# EasyEDA Pro project 新Exlink多功能调试器.epro, schematic 功率控制板

## Sheets
1 电源部分: Board Name: 功率控制板; Create Date: 2024-09-24; Page Name: 电源部分; Project Name: 改进新Exlink多功能调试器（分立叠板）; Schematic Name: 功率控制板; Update Date: 2024-10-16; Company: 嘉立创EDA; Page Size: A4; Version: V1.0
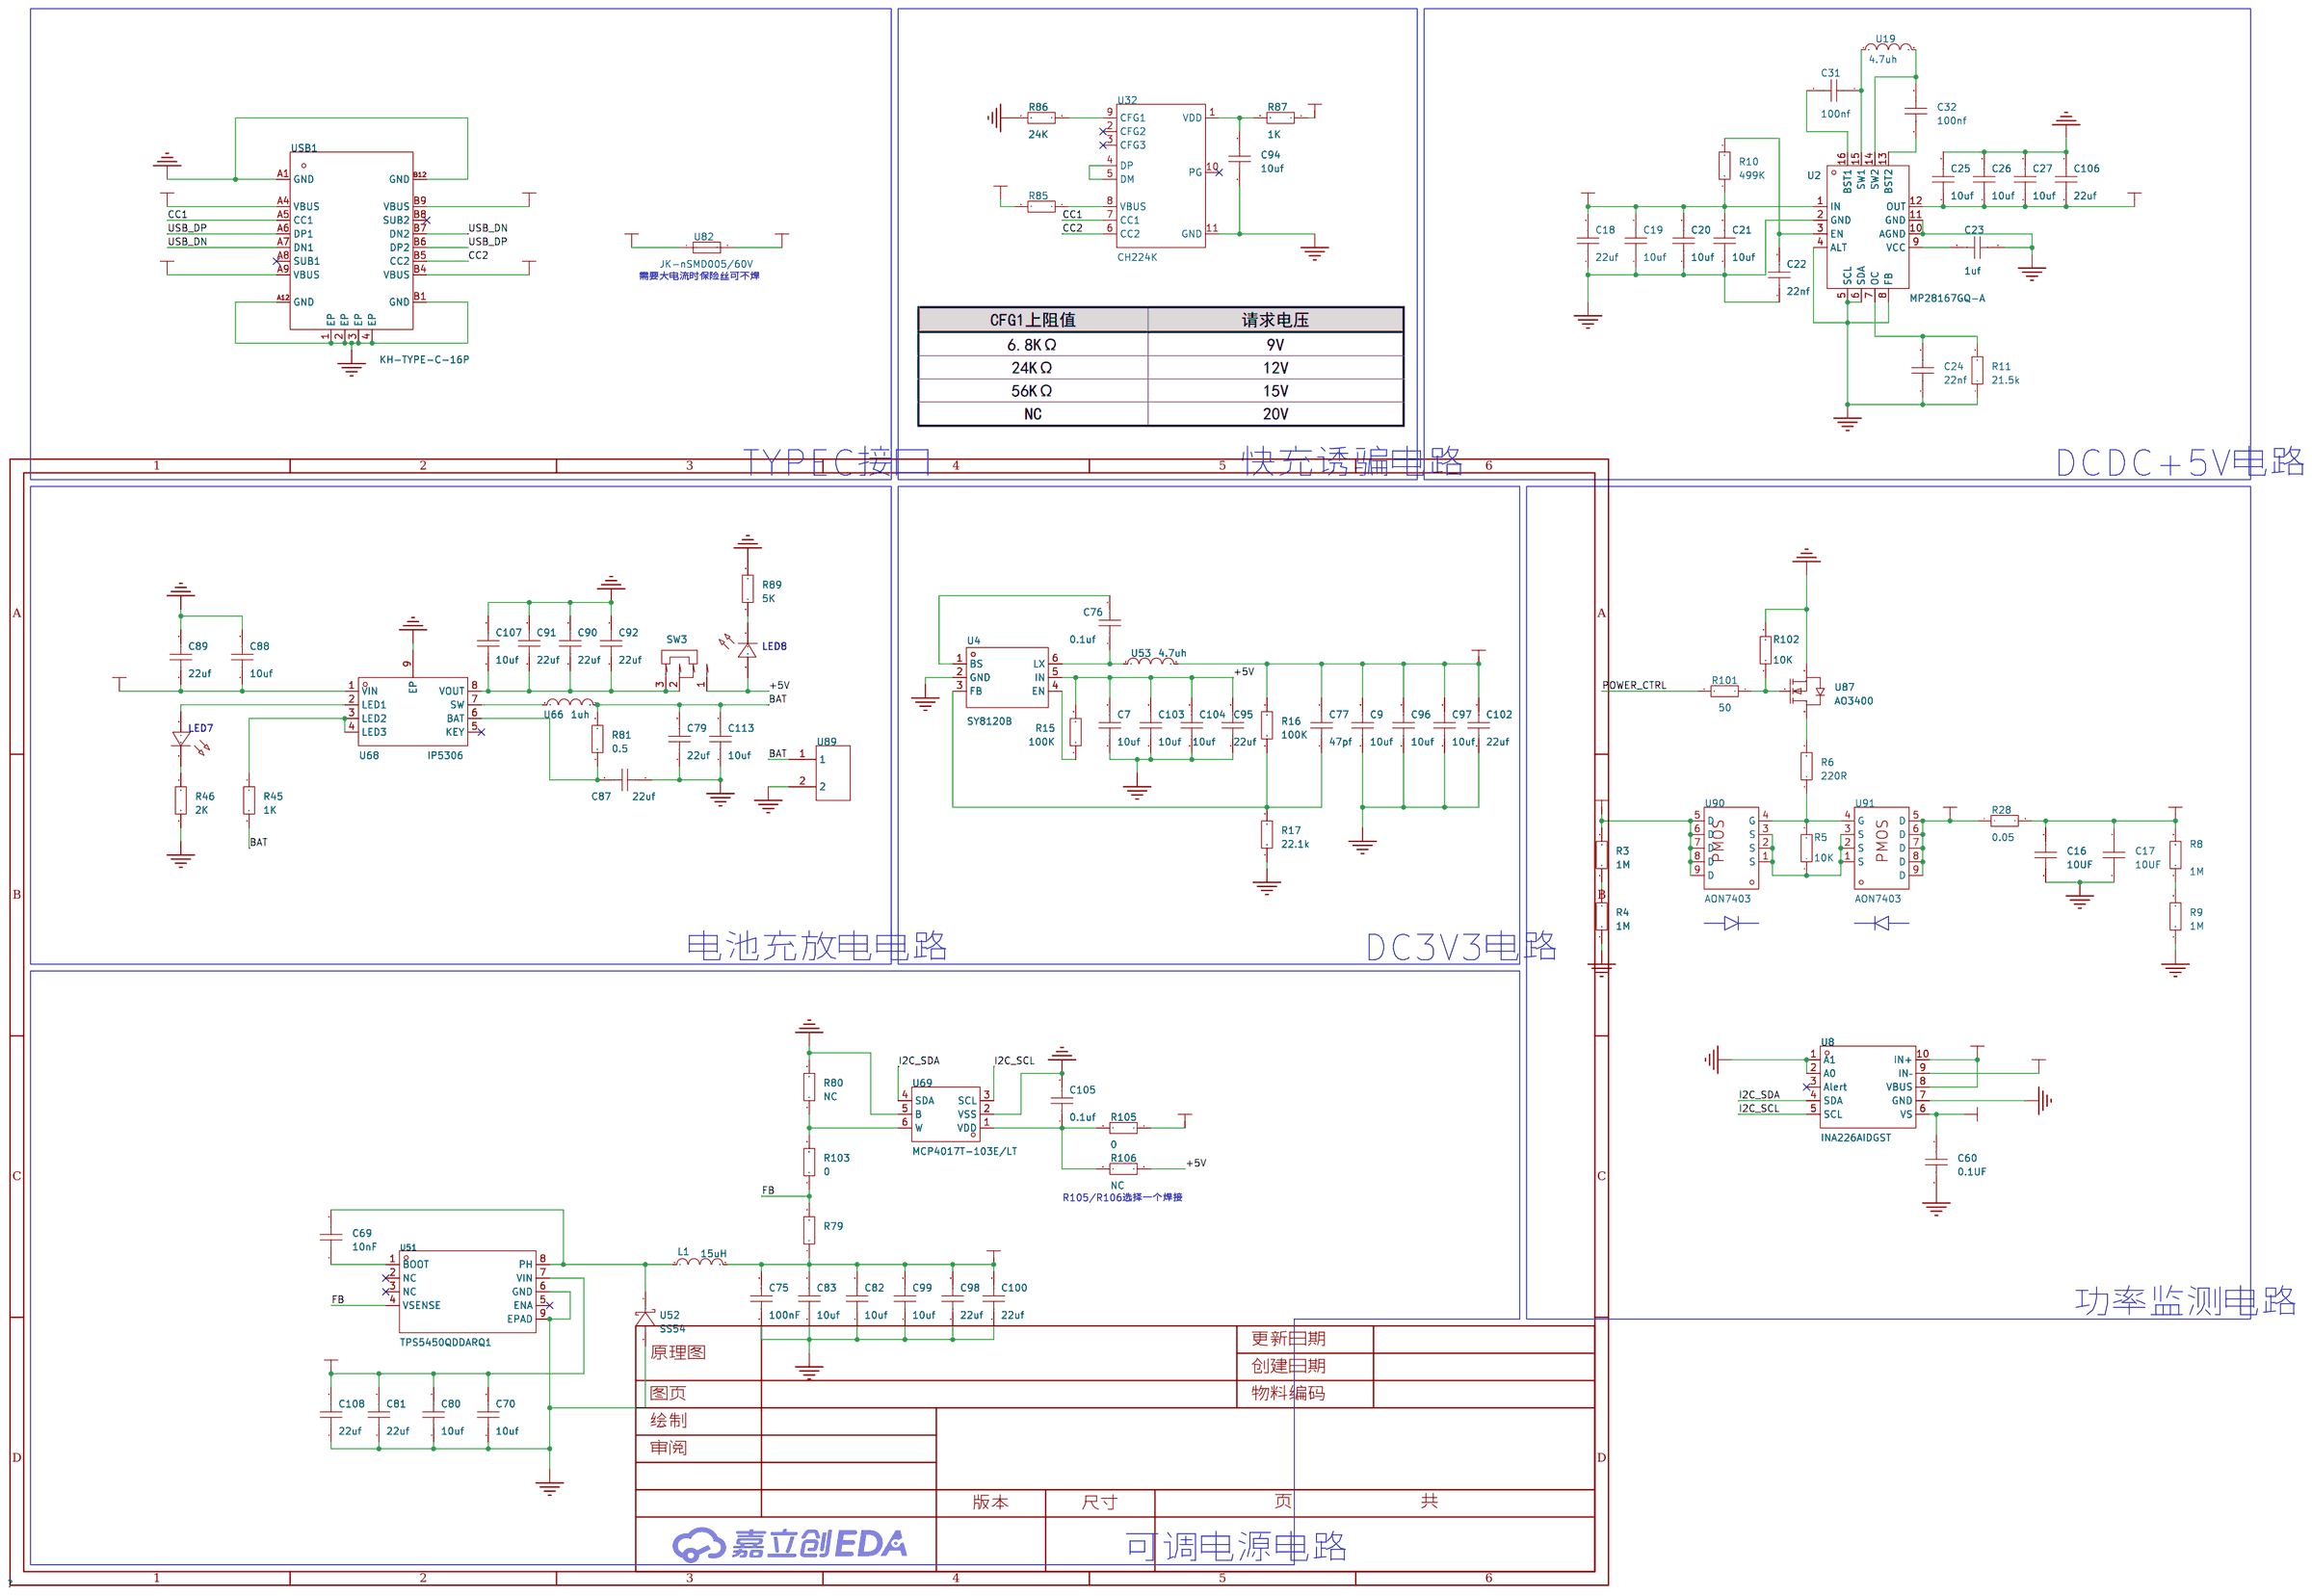
[diagram p1: 电源部分]
2 主控部分: Page Name: 主控部分; Update Date: 2024-10-17
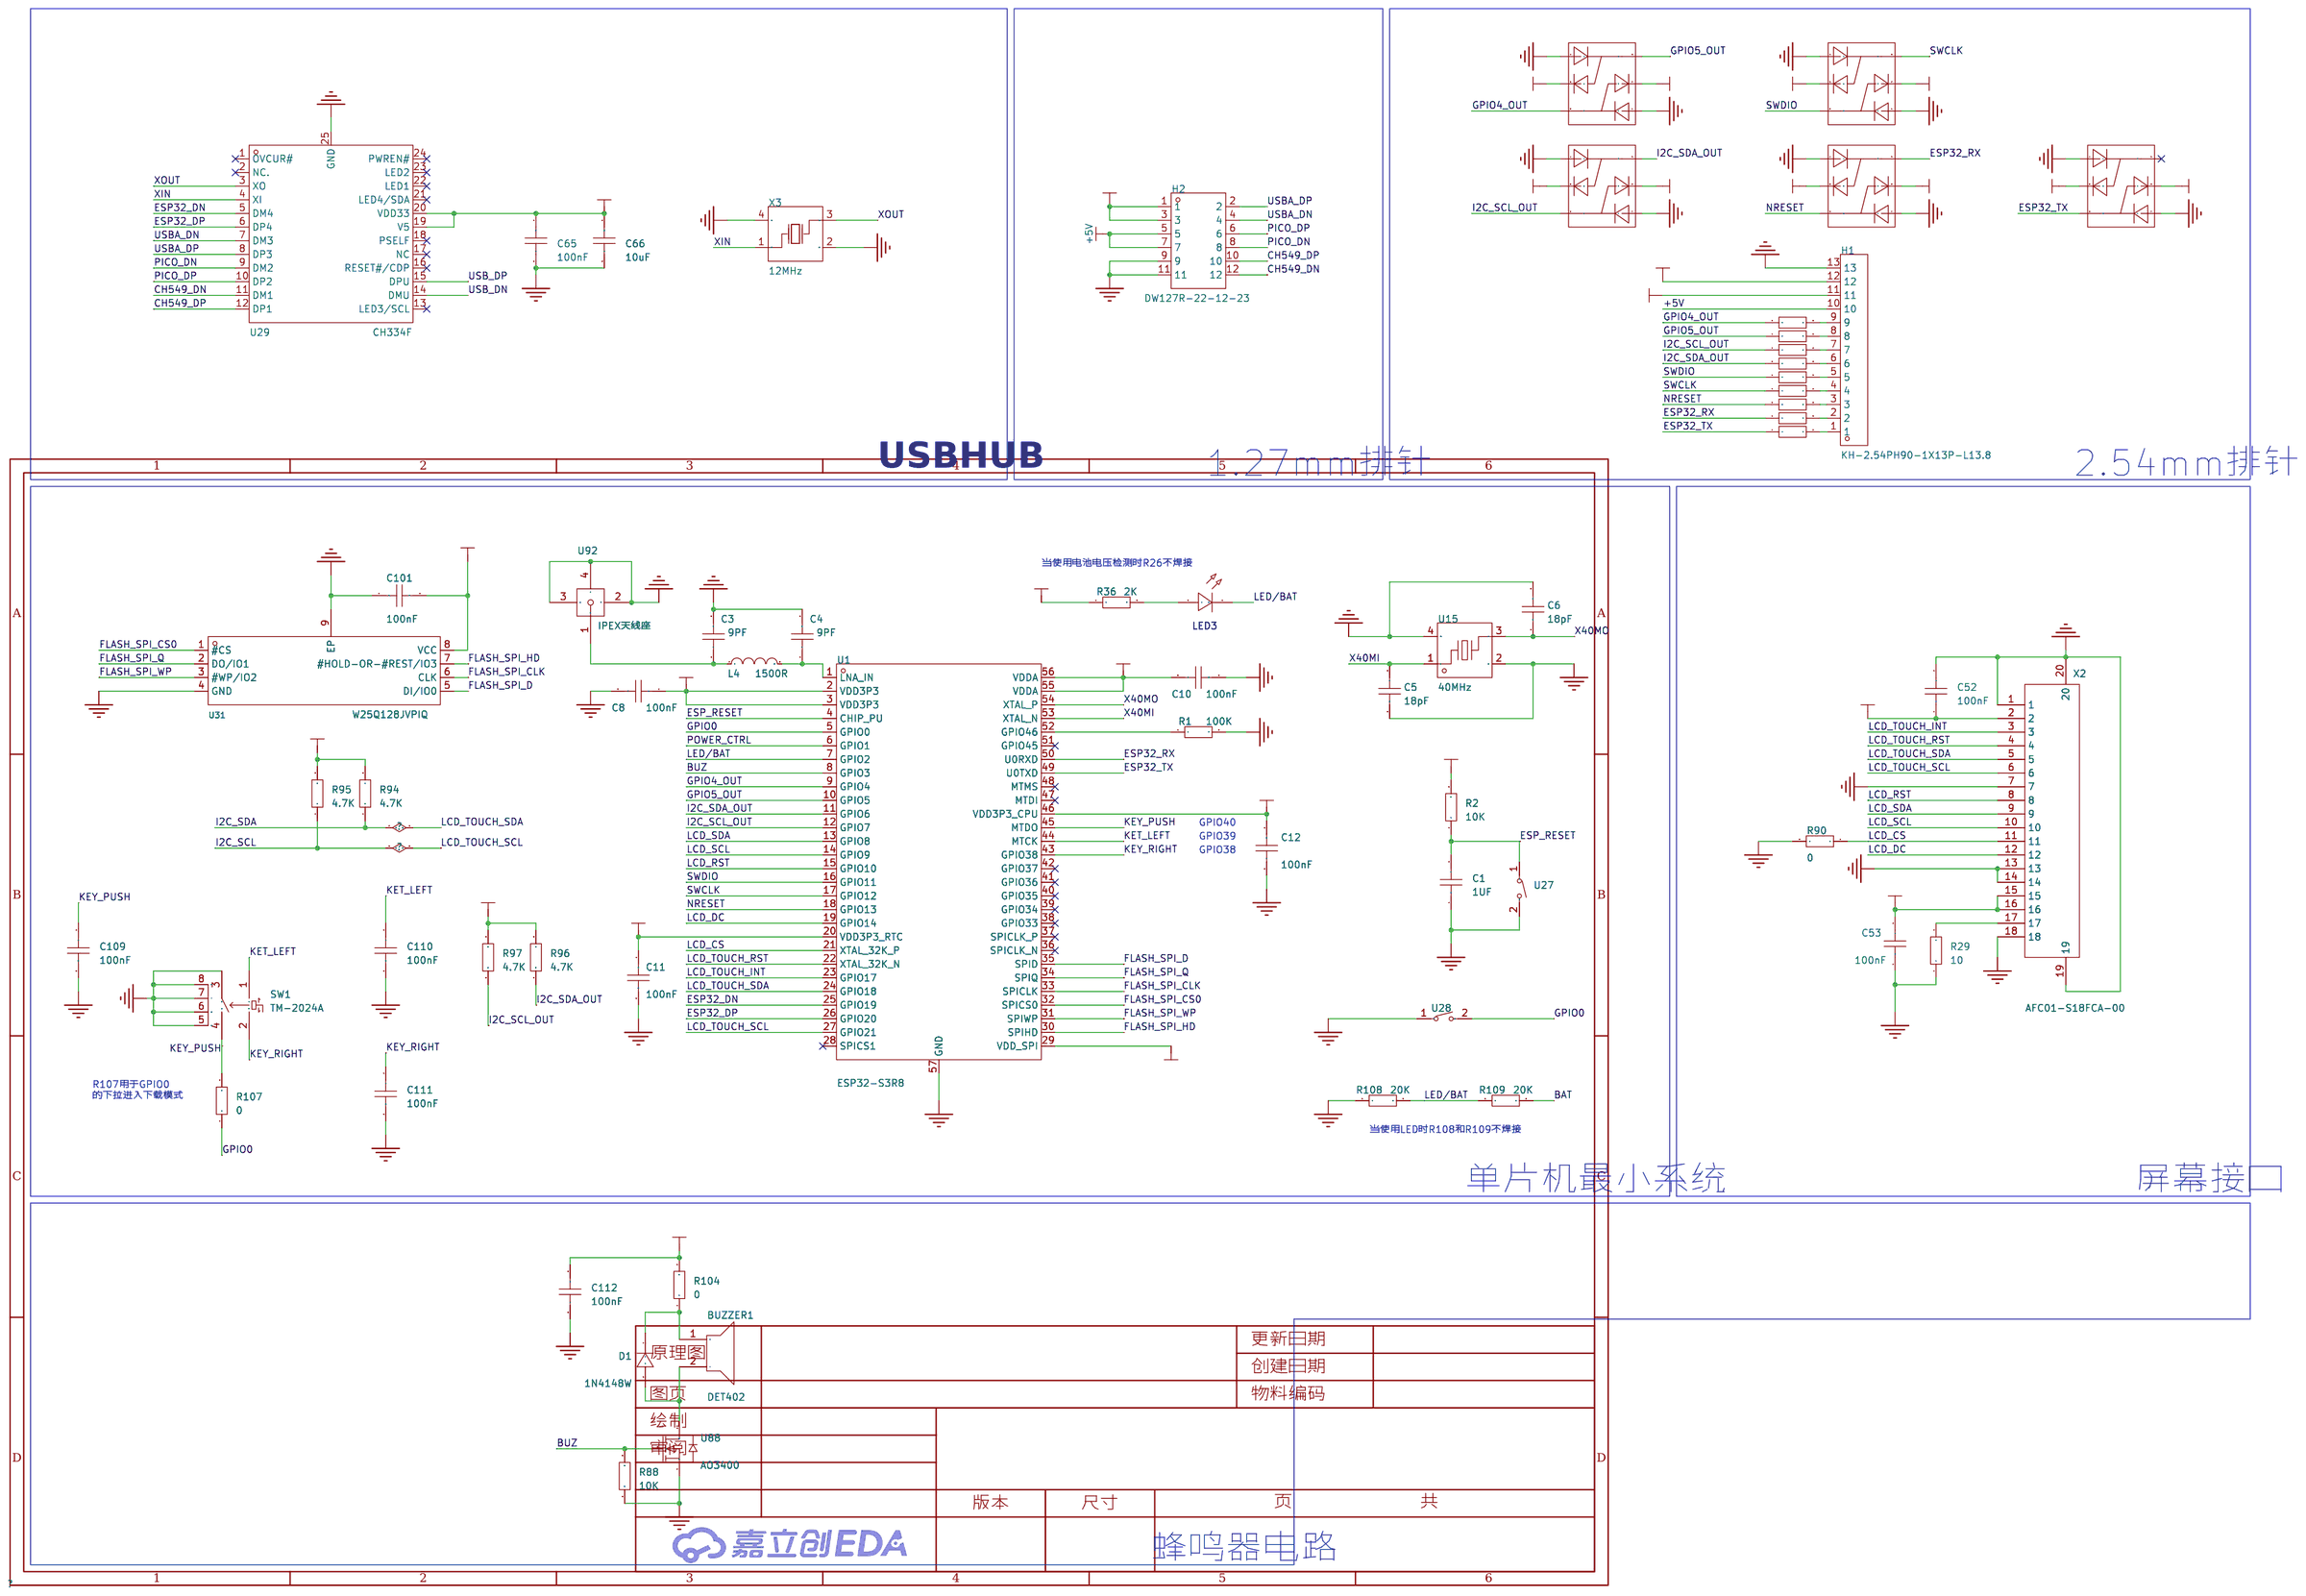
[diagram p2: 主控部分]
3 系统框图: Create Date: 2024-10-17; Page Name: 系统框图; Update Date: 2024-10-17
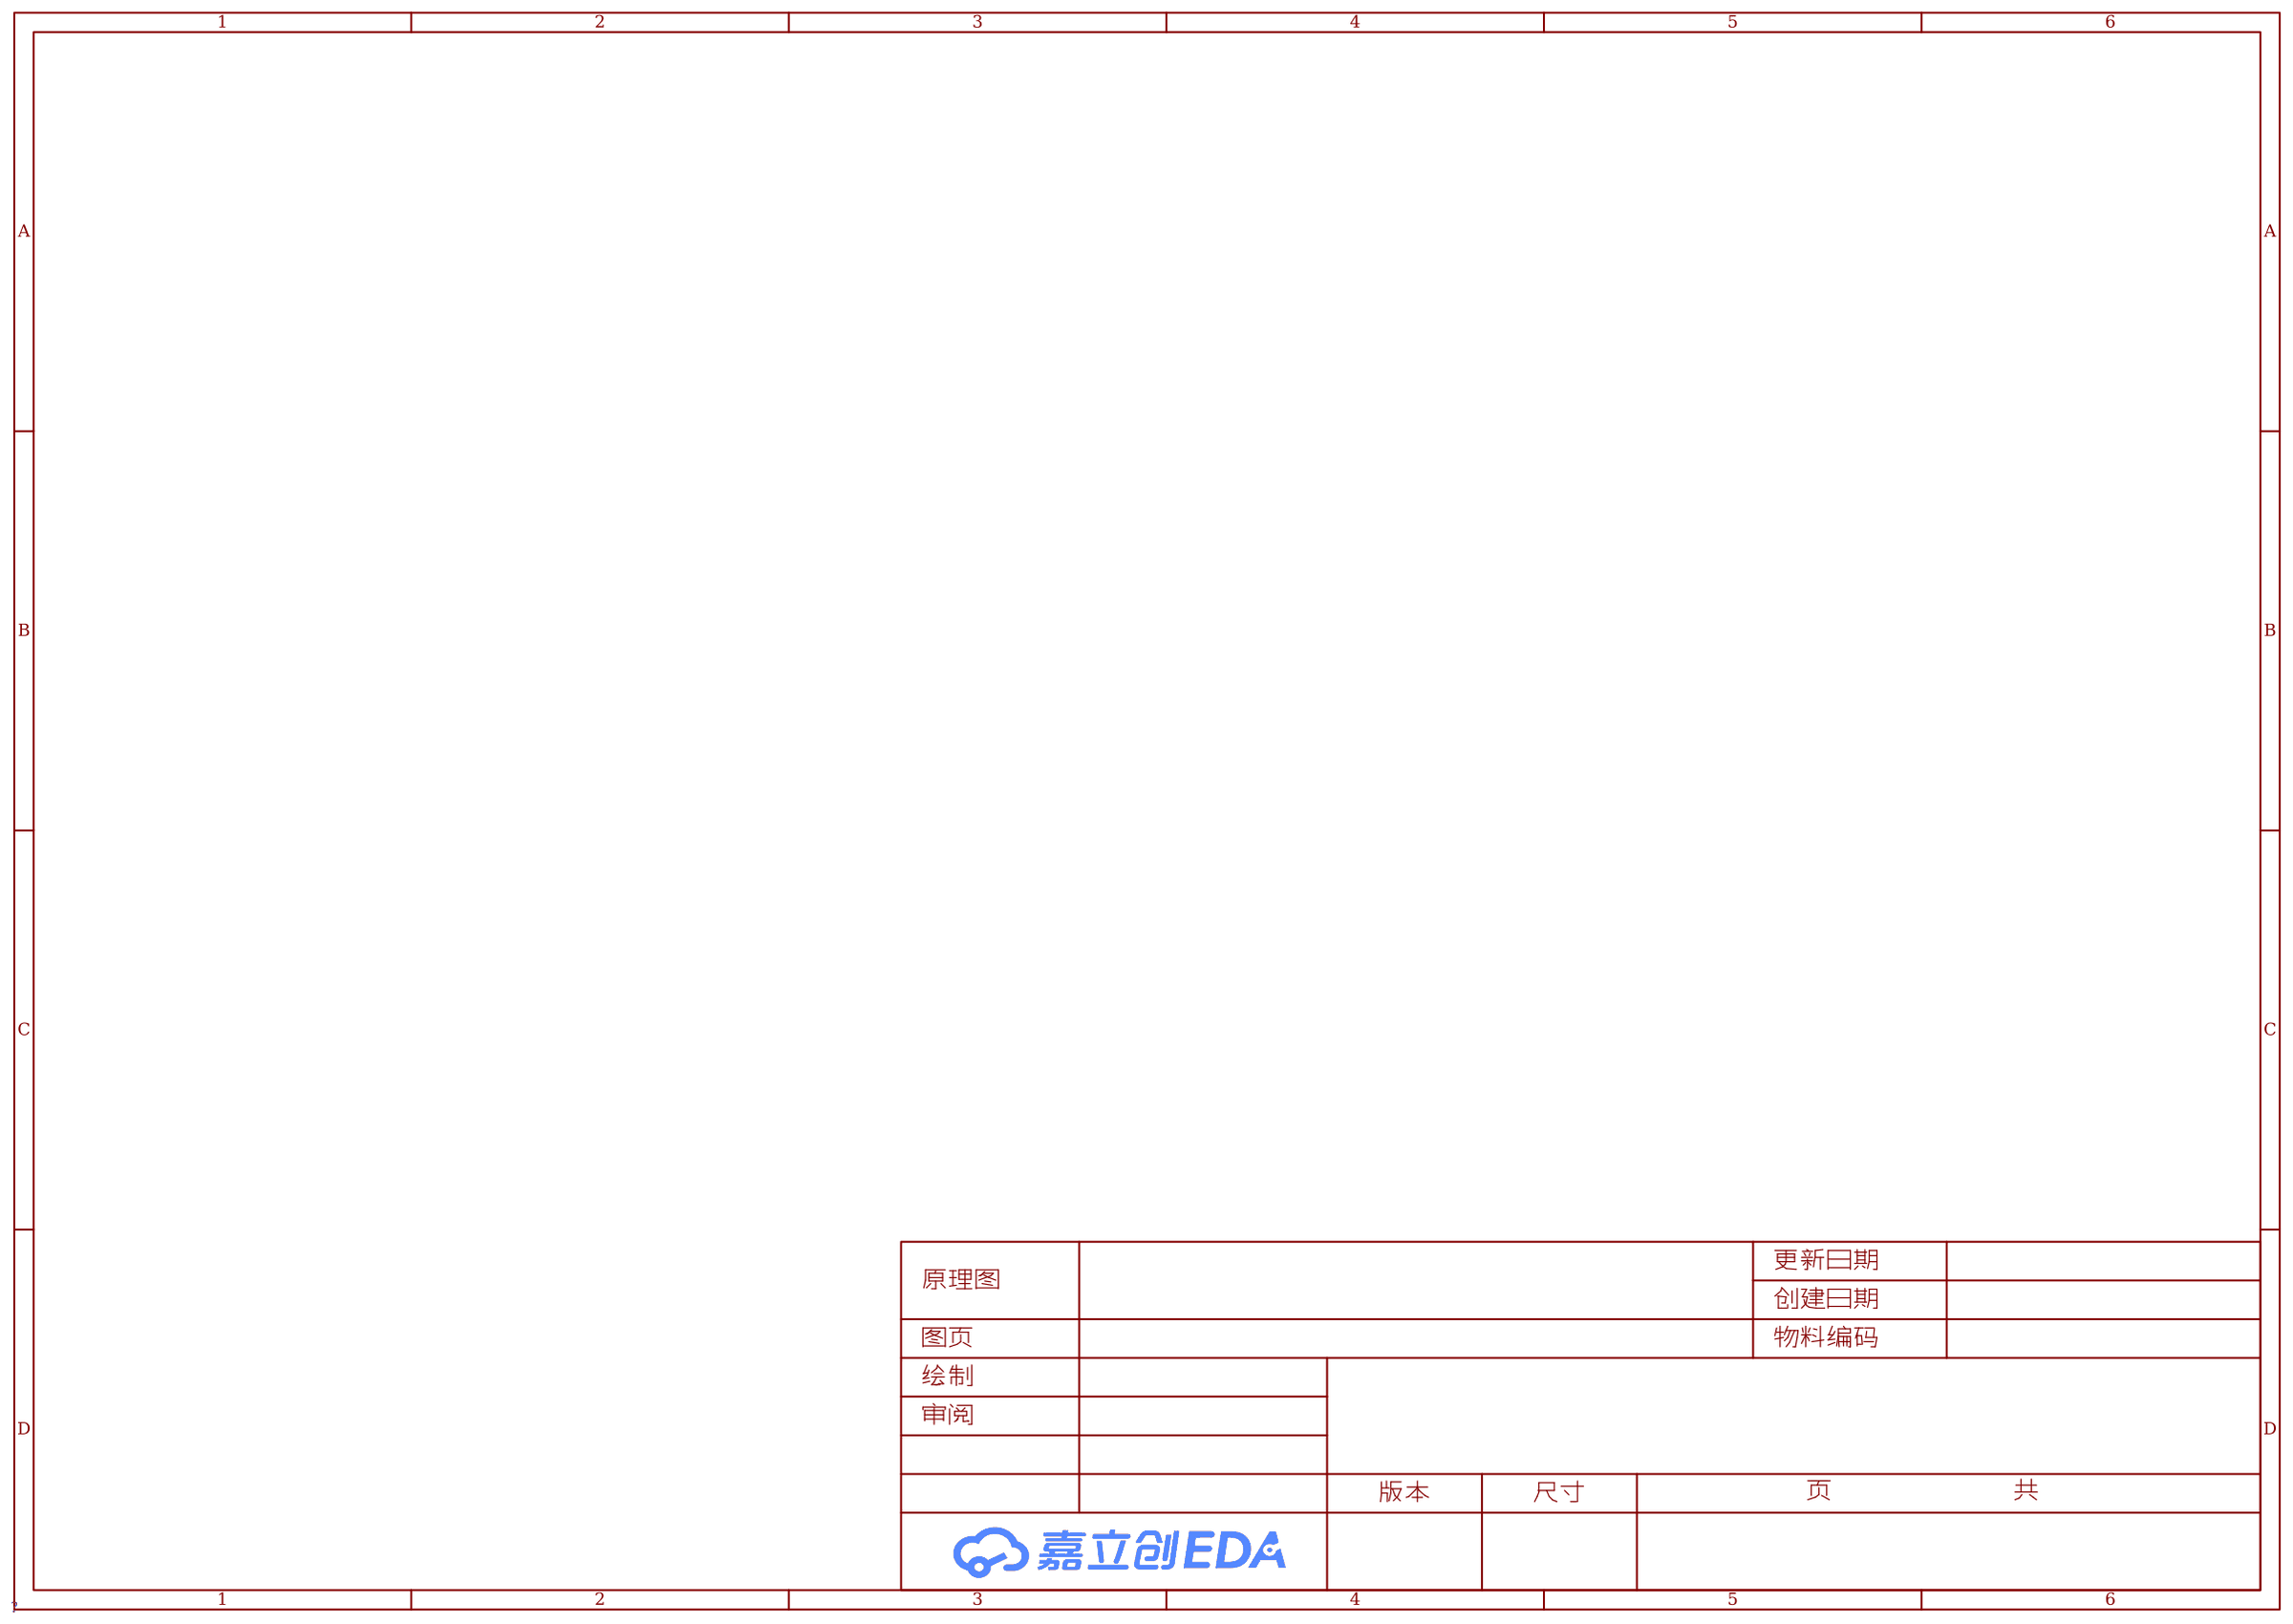
[diagram p3: 系统框图]

## Parts
sheet 主控部分
BUZZER1  DET402  [BUZ-SMD_L4.0-W3.0-LS4.5-FD]
C1  1UF  [C0402]
C3  9PF  [C0402]
C4  9PF  [C0402]
C5  18pF  [C0402]
C6  18pF  [C0402]
C8  100nF  [C0402]
C10  100nF  [C0402]
C11  100nF  [C0402]
C12  100nF  [C0402]
C52  100nF  [C0402]
C53  100nF  [C0402]
C65  100nF  [C0402]
C66  10uF  [C0402]
C101  100nF  [C0402]
C109  100nF  [C0402]
C110  100nF  [C0402]
C111  100nF  [C0402]
C112  100nF  [C0402]
D1  1N4148W  [SOD-123F_L2.7-W1.6-LS3.8-RD]
H1  KH-2.54PH90-1X13P-L13.8  [HDR-TH_13P-P2.54-H-M-W10.4-N]
H2  DW127R-22-12-23  [HDR-TH_12P-P1.27-V-M-R2-C6-S1.27-1]
L4  1500R  [L0402]
LED3  -  [LED_0402]
R1  100K  [R0402]
R2  10K  [R0402]
R29  10  [R0402]
R36  2K  [R0402]
R49  33Ω  [R0402]
R50  33Ω  [R0402]
R51  33Ω  [R0402]
R52  33Ω  [R0402]
R53  33Ω  [R0402]
R54  33Ω  [R0402]
R55  33Ω  [R0402]
R56  33Ω  [R0402]
R57  33Ω  [R0402]
R88  10K  [R0402]
R90  0  [R0402]
R94  4.7K  [R0402]
R95  4.7K  [R0402]
R96  4.7K  [R0402]
R97  4.7K  [R0402]
R104  0  [R0402]
R107  0  [R0402]
R108  20K  [R0402]
R109  20K  [R0402]
SW1  TM-2024A  [SW-SMD_TM-2024A]
U1  ESP32-S3R8  [QFN-56_L7.0-W7.0-P0.40-TL-EP4.0]
U15  40MHz  [CRYSTAL-SMD_4P-L3.2-W2.5-BL]
U27  TC-S3403-2.0-260G  [SW-SMD_L4.0-W3.0-LS5.0]
U28  TC-S3403-2.0-260G  [SW-SMD_L4.0-W3.0-LS5.0]
U29  CH334F  [QFN-24_L4.0-W4.0-P0.50-BL-EP2.8]
U31  W25Q128JVPIQ  [WSON-8_L6.0-W5.0-P1.27-BL-EP]
U71  BAV99S  [SOT-363-6_L2.0-W1.3-P0.65-LS2.1-BL]
U83  BAV99S  [SOT-363-6_L2.0-W1.3-P0.65-LS2.1-BL]
U84  BAV99S  [SOT-363-6_L2.0-W1.3-P0.65-LS2.1-BL]
U85  BAV99S  [SOT-363-6_L2.0-W1.3-P0.65-LS2.1-BL]
U86  BAV99S  [SOT-363-6_L2.0-W1.3-P0.65-LS2.1-BL]
U88  AO3400  [SOT-23-3_L2.9-W1.3-P1.90-LS2.4-BL-2]
U92  IPEX天线座  [IPEX-SMD_HC-RF-IPEX0303-01]
X2  AFC01-S18FCA-00  [FPC-SMD_18P-P0.50_JS_AFC01-S18FCA-00]
X3  12MHz  [OSC-SMD_4P-L3.2-W2.5-BL]
sheet 电源部分
C7  10uf  [C0402]
C9  10uf  [C0402]
C16  10UF  [C0402]
C17  10UF  [C0402]
C18  22uf  [C0402]
C19  10uf  [C0402]
C20  10uf  [C0402]
C21  10uf  [C0402]
C22  22nf  [C0402]
C23  1uf  [C0402]
C24  22nf  [C0402]
C25  10uf  [C0402]
C26  10uf  [C0402]
C27  10uf  [C0402]
C31  100nf  [C0402]
C32  100nf  [C0402]
C60  0.1UF  [C0402]
C69  10nF  [C0402]
C70  10uf  [C0402]
C75  100nF  [C0402]
C76  0.1uf  [C0402]
C77  47pf  [C0402]
C79  22uf  [C0402]
C80  10uf  [C0402]
C81  22uf  [C0402]
C82  10uf  [C0402]
C83  10uf  [C0402]
C87  22uf  [C0402]
C88  10uf  [C0402]
C89  22uf  [C0402]
C90  22uf  [C0402]
C91  22uf  [C0402]
C92  22uf  [C0402]
C94  10uf  [C0402]
C95  22uf  [C0402]
C96  10uf  [C0402]
C97  10uf  [C0402]
C98  22uf  [C0402]
C99  10uf  [C0402]
C100  22uf  [C0402]
C102  22uf  [C0402]
C103  10uf  [C0402]
C104  10uf  [C0402]
C105  0.1uf  [C0402]
C106  22uf  [C0402]
C107  10uf  [C0402]
C108  22uf  [C0402]
C113  10uf  [C0402]
L1  15uH  [IND-SMD_L4.0-W4.0_FNR40XXS]
LED7  -  [LED_0402]
LED8  -  [LED_0402]
R3  1M  [R0402]
R4  1M  [R0402]
R5  10K  [R0402]
R6  220R  [R0402]
R8  1M  [R0402]
R9  1M  [R0402]
R10  499K  [R0402]
R11  21.5k  [R0402]
R15  100K  [R0402]
R16  100K  [R0402]
R17  22.1k  [R0402]
R28  0.05  [R1206]
R45  1K  [R0402]
R46  2K  [R0402]
R79  10K  [R0402]
R80  NC  [R0402]
R81  0.5  [R0402]
R85  10K  [R0402]
R86  24K  [R0402]
R87  1K  [R0402]
R89  5K  [R0402]
R101  50  [R0402]
R102  10K  [R0402]
R103  0  [R0402]
R105  0  [R0402]
R106  NC  [R0402]
SW3  SK-3245S-L1-A  [SW-SMD_SK-3245S-L1-A-1]
U2  MP28167GQ-A  [QFN-16_L3.0-W3.0-P0.50_MP28167GQ-Z]
U4  SY8120B  [SOT-23-6_L2.9-W1.6-P0.95-LS2.8-BL]
U8  INA226AIDGST  [VSSOP-10_L3.0-W3.0-P0.50-LS4.9-BL]
U19  4.7uh  [IND-SMD_L2.5-W2.0_YXNAQ252010-3R3M]
U32  CH224K  [ESSOP-10_L4.9-W3.9-P1.0-LS6.0-TL-EP]
U51  TPS5450QDDARQ1  [SOIC-8_L4.9-W3.9-P1.27-LS6.0-BL-EP]
U52  SS54  [SMA_L4.2-W2.6-LS5.1-RD]
U53  4.7uh  [IND-SMD_L2.5-W2.0_YXNAQ252010-3R3M]
U66  1uh  [IND-SMD_L2.5-W2.0_YXNAQ252010-3R3M]
U68  IP5306  [ESOP-8_L4.9-W3.9-P1.27-LS6.0-BL-EP]
U69  MCP4017T-103E/LT  [SC-70-6_L2.2-W1.3-P0.65-LS2.1-BR]
U82  JK-nSMD005/60V  [F1206]
U87  AO3400  [SOT-23-3_L2.9-W1.3-P1.90-LS2.4-BL-2]
U89  -  [电池接口]
U90  AON7403  [DFN-8_L3.0-W3.0-P0.65-BL]
U91  AON7403  [DFN-8_L3.0-W3.0-P0.65-BL]
USB1  KH-TYPE-C-16P  [USB-C-SMD_KH-TYPE-C-16P]

## Library data of the parts
BUZZER1 = DET402: Supplier Part: C2911630; Supplier Footprint: SMD; JLCPCB Part Class: 扩展库; Supplier: LCSC
C1 C5 C6 C8 C10-C12 C16-C27 C31 C32 C79-C83 C87-C92 C94 C98-C101 C105-C113 = CAP_0603: Supplier Footprint: 0603
C3 C4 C52 C53 C60 C65 C66 = CAP_0402: Supplier Footprint: 0402
D1 = 1N4148W_C81598: 二极管配置:独立式;正向压降(Vf):1V@50mA;直流反向耐压(Vr):75V;平均整流电流(Io):150mA;功率:400mW;反向恢复时间(trr):4ns;; LCSC Part Name: 电压:75V 电流:150mA; Supplier Part: C81598; Manufacturer: ST(先科); Supplier Footprint: SOD-123; JLCPCB Part Class: 基础库; Datasheet: https://atta.szlcsc.com/upload/public/pdf/source/20161024/1477288446905.pdf; Supplier: LCSC; Diode Configuration: 独立式; Forward Voltage (Vf@If): 1V@50mA; Reverse Voltage (Vr): 75V; Average Rectified Current (Io): 150mA; Power Dissipation: 400mW; Reverse Leakage Current: 1uA@75V; Reverse Recovery Time (trr): 4ns
H1 = KH-2.54PH90-1X13P-L13.8: 插针结构:1x13P;间距:2.54mm;行距:-;圆针/方针:方针;安装类型:弯插;排数:单排;总PIN位数:13P;额定电流:3A;额定电压:-;配合针长度:6mm;塑高:2.5mm;端接针长度:-;工作温度范围:-40℃~+105℃;颜色:黑色;; LCSC Part Name: 间距:2.54mm 1x13P 弯插 方针; Supplier Part: C2932694; Manufacturer: kinghelm(金航标); Supplier Footprint: 弯插,P=2.54mm; JLCPCB Part Class: 扩展库; Datasheet: https://atta.szlcsc.com/upload/public/pdf/source/20211220/56DAC73D7461283ED3EEF54E5429CBF7.pdf; Supplier: LCSC; Pin Structure: 1x13P; Pitch: 2.54mm; Circluar Pins/Square Pins: 方针; Mounting Type: 弯插; Number of Rows: 单排; Number of Pins: 13P; Current Rating (Max): 3A; Length of Mating Pin: 6mm; Insulation Height: 2.5mm; Operating Temperature Range: -40℃~+105℃; Color: 黑色
H2 = DW127R-22-12-23: 插针结构:2x6P;间距:1.27mm;行距:1.27mm;圆针/方针:方针;安装类型:直插;排数:双排;总PIN位数:12P;额定电流:1A;额定电压:-;配合针长度:3mm;塑高:1mm;端接针长度:2.3mm;工作温度范围:-;颜色:-;; LCSC Part Name: 间距:1.27mm 2x6P 直插 方针; Supplier Part: C2935954; Manufacturer: DEALON(德艺隆); Supplier Footprint: 插件,P=1.27mm; JLCPCB Part Class: 扩展库; Datasheet: https://atta.szlcsc.com/upload/public/pdf/source/20220110/33FE2FFCEFD15AF13AB1987E70EA4ABA.pdf; Supplier: LCSC; Pin Structure: 2x6P; Pitch: 1.27mm; Row Spacing: 1.27mm; Circluar Pins/Square Pins: 方针; Mounting Type: 直插; Number of Rows: 双排; Number of Pins: 12P; Current Rating (Max): 1A; Length of Mating Pin: 3mm; Insulation Height: 1mm; Length of End Connection Pin: 2.3mm
L4 = L_0402
LED3 = LED_0402-G: Supplier Footprint: 0402
R1-R6 R8-R11 R36 R45 R46 R81 R88 R89 R94-R97 R101 R102 R104 R107-R109 = Res_0603: Supplier Footprint: 0603
R29 R90 = Res_0402: Supplier Footprint: 0402
R49-R57 = RC0201FR-072R2L: 电阻类型:厚膜电阻;阻值:2.2Ω;精度:±1%;功率:50mW;; LCSC Part Name: 2.2Ω ±1% 50mW; Supplier Part: C138154; Manufacturer: YAGEO(国巨); Supplier Footprint: 0201; JLCPCB Part Class: 扩展库; Datasheet: https://atta.szlcsc.com/upload/public/pdf/source/20171107/C138154_15100517264731097049.pdf; Supplier: LCSC; Type: 厚膜电阻; Tolerance: ±1%; Power(Watts): 50mW; Temperature Coefficient: -100ppm/℃~+350ppm/℃; Overload Voltage (Max): 25V; Operating Temperature Range: -55℃~+125℃
SW1 = TM-2024A: 四脚两档拨轮开关TM-2024A; LCSC Part Name: 四脚两档拨轮开关TM-2024A; Supplier Part: C561480; Manufacturer: XKB Connection(中国星坤); Supplier Footprint: SMD; JLCPCB Part Class: 扩展库; Datasheet: https://atta.szlcsc.com/upload/public/pdf/source/20211011/7A4DB3DC37E7D5823B6D92C66ED3191E.pdf; Supplier: LCSC
U1 = ESP32-S3R8: 频率范围:2.412GHz~2.484GHz;接口:I2C,I2S,SPI,UART,USB;应用领域:蓝牙,WiFi;数据速率:150Mbps;灵敏度:-98.4dBm;; Supplier Part: C2913194; Manufacturer: ESPRESSIF(乐鑫); Supplier Footprint: QFN-56(7x7); JLCPCB Part Class: 扩展库; Datasheet: https://atta.szlcsc.com/upload/public/pdf/source/20231007/CDA236FFCB3F25B7D5220D2CA9867287.pdf; Supplier: LCSC; Frequency Range: 2.412GHz~2.484GHz; Interface: I2C,I2S,SPI,UART,USB; Operating Voltage: 3.3V; Applications: 蓝牙,WiFi; Output Power: 21dBm; Data Rate: 150Mbps; Sensitivity: -98.4dBm; Operating Temperature: -40℃~+85℃
U15 = L327S400H11L: 晶振类型:贴片晶振;频率:40MHz;常温频差:±10ppm;外接负载电容:10pF;; LCSC Part Name: 40MHz ±10ppm 10pF; Supplier Part: C5261245; Manufacturer: Lucki(蓝晶); Supplier Footprint: SMD3225-4P; Datasheet: https://atta.szlcsc.com/upload/public/pdf/source/20221202/3BD521BEB23A8C516134756D2665894B.pdf; Supplier: LCSC; Crystal Type: 贴片晶振; Normal temperature Frequency Tolerance: ±10ppm; External load capacitor: 10pF; Operating Temperature: -40℃~+85℃
U27 U28 = TC-S3403-2.0-260G: 连接器类型：3.5mm耳机座 额定电流：500mA 额定电压：30V 工作温度范围：-20℃~+70℃ 焊接温度(最大值)：235℃ 3.5音频连接器 5脚3级插脚 音响耳机插座; Supplier Part: C5372844; Manufacturer: HCTL(华灿天禄); Supplier Footprint: SMD; Datasheet: https://atta.szlcsc.com/upload/public/pdf/source/20230320/549E467C3F97F31F1E4EF0A0B79060CE.pdf; Supplier: LCSC
U29 = CH334F: Supplier Part: C9900029063; Supplier Footprint: QFN24_4x4; Supplier: LCSC
U31 = W25Q128JVPIQ_C190862: 存储容量:128Mbit;; Supplier Part: C190862; Manufacturer: WINBOND(华邦); Supplier Footprint: WSON-8-EP(5x6); JLCPCB Part Class: 扩展库; Datasheet: https://atta.szlcsc.com/upload/public/pdf/source/20190705/C401662_06B6D416F67ED315879B366F63A3F7C9.pdf; Supplier: LCSC; Memory Size: 128Mbit
U71 U83-U86 = BAV99S_1: 二极管配置:2对串联式;正向压降(Vf):1.25V@150mA;直流反向耐压(Vr):85V;平均整流电流(Io):150mA;反向恢复时间(trr):6ns;; LCSC Part Name: 电压:85V 电流:150mA; Supplier Part: C19267766; Manufacturer: HXY MOSFET(华轩阳电子); Supplier Footprint: SOT-363; JLCPCB Part Class: 扩展库; Datasheet: https://atta.szlcsc.com/upload/public/pdf/source/20231127/314B1A7F84308C808926EA57C3E5ACE3.pdf; Supplier: LCSC; Diode Configuration: 2对串联式; Forward Voltage (Vf@If): 1.25V@150mA; Reverse Voltage (Vr): 85V; Average Rectified Current (Io): 150mA; Reverse Recovery Time (trr): 6ns
U87 U88 = AO3400: Supplier Part: C9900013365; Supplier Footprint: SOT-23; JLCPCB Part Class: 扩展库; Supplier: LCSC
U92 = IPEX天线座: Supplier Part: C9900012747; Supplier Footprint: IPEX-SMD; JLCPCB Part Class: 扩展库; Supplier: LCSC
X2 = AFC01-S18FCA-00: 间距:0.5mm;触点数量:18;锁定特性:翻盖式;安装类型:卧贴;触点类型:下接;工作温度范围:-;; LCSC Part Name: 0.5mmP数:18翻盖式下接; Supplier Part: C262666; Manufacturer: JS(钜硕电子); Supplier Footprint: SMD,P=0.5mm; JLCPCB Part Class: 扩展库; Datasheet: https://atta.szlcsc.com/upload/public/pdf/source/20190816/C413942_2A72D1AC756EAE17EEDF756A339D4500.pdf; Supplier: LCSC; Pitch: 0.5mm; Number of Contacts: 18; Locking Feature: 翻盖式; Mounting Type: 卧贴; Contact Type: 下接; Height Above Board: 2mm; FFC, FCB Thickness: 0.3mm
X3 = X322512MSB4SI: 晶振类型:贴片晶振;频率:12MHz;常温频差:±10ppm;外接负载电容:20pF;频率稳定度(全温):±20ppm;; LCSC Part Name: 12MHz ±10ppm 20pF; Supplier Part: C9002; Manufacturer: YXC(扬兴晶振); Supplier Footprint: SMD3225-4P; JLCPCB Part Class: 基础库; Datasheet: https://atta.szlcsc.com/upload/public/pdf/source/20240329/19D5F850207469550BEB00D7DFEDBC7A.pdf; Supplier: LCSC; Crystal Type: 贴片晶振; Normal temperature Frequency Tolerance: ±10ppm; External load capacitor: 20pF; Frequency Stability(Full temperature range): ±20ppm; Operating Temperature: -40℃~+85℃
C7 C9 C69 C70 C75-C77 C95-C97 C102-C104 = CAP_0805: Supplier Footprint: 0805
L1 = FNR4020S4R7MT: 电感值:4.7uH;精度:±20%;额定电流:1.34A;直流电阻(DCR):98mΩ;; LCSC Part Name: 4.7uH ±20% 1.34A 98mΩ; Supplier Part: C167828; Manufacturer: cjiang(长江微电); Supplier Footprint: SMD,4x4x2mm; JLCPCB Part Class: 扩展库; Datasheet: https://atta.szlcsc.com/upload/public/pdf/source/20190327/C167828_0C146B75E465FFC746F4145E84B3A0D4.pdf; Supplier: LCSC; Tolerance: ±20%; Rated Current: 1.34A; DC Resistance (DCR): 98mΩ
LED7 LED8 = LED_0603-G: Supplier Footprint: 0603
R15-R17 R79 R80 R85-R87 R103 R105 R106 = Res_0805: Supplier Footprint: 0805
R28 = Res_1206: Supplier Footprint: 1206
SW3 = SK-3245S-L1-A: 电路结构:双刀双掷;安装方式:卧贴;开关颜色:黑色;额定电流(DC):50mA;额定电压(DC):12V;额定电流(AC):50mA;额定电压(AC):12V;机械寿命:1万次;; LCSC Part Name: 柄长2mm 卧贴双档 滑动开关; Supplier Part: C405951; Manufacturer: XKB Connection(中国星坤); Supplier Footprint: SMD; JLCPCB Part Class: 扩展库; Datasheet: https://atta.szlcsc.com/upload/public/pdf/source/20200227/C405951_CBAB505F81ACCB08512C6DA919ADD92C.pdf; Supplier: LCSC; Circuit: 双刀双掷; Actuator Style: 矩形柱状; Pin Style: SMD接片; Switch Length: 9.1mm; Switch Width: 3.55mm; Switch Height: 3.2mm; Mounting Style: 卧贴; Actuator Color: 黑色; Current Rating (DC): 50mA; Voltage Rating (DC): 12V; Current Rating (AC): 50mA; Voltage Rating (AC): 12V; Mechanical Life: 1万次; Operating Temperature: -40℃~+85℃
U2 = MP28167GQ-A: Supplier Part: C3445916; Supplier Footprint: QFN-16(3x3); JLCPCB Part Class: 扩展库; Supplier: LCSC
U4 = SY8120B: LCSC Part Name: 2A, 18V, 600KHz同步降压转换器; Supplier Part: C5330397; Manufacturer: Slkor(萨科微); Supplier Footprint: SOT-23-6; Datasheet: https://atta.szlcsc.com/upload/public/pdf/source/20221213/05E3E36F9B4BD6CBAE1D86C5271B65DD.pdf; Supplier: LCSC
U8 = INA226AIDGST: INA226 具有警报功能的 36V、16 位、超精密 I2C 输出电流/电压/功率监控器; Supplier Part: C2653870; Manufacturer: TI(德州仪器); Supplier Footprint: VSSOP-10-0.5mm; Datasheet: https://www.ti.com/cn/lit/gpn/ina226; Supplier: LCSC
U19 U53 U66 = IND\L2.5XW: Supplier Part: C9900016568; Supplier Footprint: 2.2uH/60; JLCPCB Part Class: 扩展库; Supplier: LCSC
U32 = CH224K: 应用功能:USB充电芯片;; LCSC Part Name: USB PD等多快充协议受电芯片CH224; Supplier Part: C970725; Manufacturer: WCH(南京沁恒); Supplier Footprint: ESSOP-10-150mil-1mm; JLCPCB Part Class: 扩展库; Datasheet: https://atta.szlcsc.com/upload/public/pdf/source/20240313/43C2AFDDBDD1F65B60386D2CCAB0811B.pdf; Supplier: LCSC; Applications Function: USB充电芯片
U51 = TPS5450QDDARQ1: 功能类型:降压型;输出类型:可调;输入电压:5.5V~36V;输出电压:1.221V~32.04V;输出电流(最大值):5A;; Supplier Part: C181270; Manufacturer: TI(德州仪器); Supplier Footprint: SOP-8-EP; JLCPCB Part Class: 扩展库; Datasheet: https://www.ti.com/cn/lit/gpn/tps5450-q1; Supplier: LCSC; Function: 降压型; Synchronous Rectification: 否; Output Type: 可调; Number of Outputs: 1; Topology: 降压式; Input Voltage: 5.5V~36V; Output Voltage: 1.221V~32.04V; Output Current (Max): 5A; Switching Frequency: 500kHz; Operating Temperature: -40℃~+125℃@(TJ)
U52 = SS54: Supplier Part: C9900023219; Supplier Footprint: (1N5824)DO-214; JLCPCB Part Class: 扩展库; Supplier: LCSC
U68 = IP5306: 2.1A充电2.4A放电高集成度移动电源SOC; Supplier Part: C181692; Manufacturer: INJOINIC(英集芯); Supplier Footprint: ESOP-8; JLCPCB Part Class: 扩展库; Datasheet: https://atta.szlcsc.com/upload/public/pdf/source/20190627/C384572_9925B3DDC4041BC6108E5AB46A2A0AB1.pdf; Supplier: LCSC
U69 = MCP4017T-103E/LT: 电阻值(欧姆):10kΩ;接口类型:I2C;供电电压:1.8V~5.5V;精度:±20%;; Supplier Part: C623396; Manufacturer: MICROCHIP(美国微芯); Supplier Footprint: SC-70-6; JLCPCB Part Class: 扩展库; Datasheet: https://atta.szlcsc.com/upload/public/pdf/source/20171212/C145561_15130636359521177681.pdf; Supplier: LCSC; Resistance Value (Ohms): 10kΩ; Number of Taps: 128; Interface Type: I2C; Number of Channels: 1; Supply Voltage: 1.8V~5.5V; Precision: ±20%; Temperature Coefficient (Typ): 150ppm/℃; Operating Temperature: -40℃~+125℃
U82 = JK-nSMD005/60V: 最大电压:60V;最大电流:100A;保持电流:50mA;跳闸电流:150mA;; LCSC Part Name: 60V 0.05A 1206自恢复; Supplier Part: C2830235; Manufacturer: JK(金科); Supplier Footprint: 1206; Datasheet: https://atta.szlcsc.com/upload/public/pdf/source/20210427/C2830251_B9511B640A50AD6A91174E2DDDD254CA.pdf; Supplier: LCSC; Operating Voltage (Max): 60V; Current Rating (Max): 100A; Hold Current: 50mA; Trip Current: 150mA; Resistance - Initial (Ri) (Min): 3.6Ω; Resistance - Post Trip (R1) (Max): 50Ω; Maximum Time to Trip: 1.5s; Operating Temperature: -40℃~+85℃
U89 = 电池接口
U90 U91 = AON7403_C5310961: Supplier Part: C5310961; Manufacturer: TECH PUBLIC(台舟); Supplier Footprint: PDFN-8; JLCPCB Part Class: 扩展库; Datasheet: https://atta.szlcsc.com/upload/public/pdf/source/20221212/36DA98EDFE73327CB4574501A775E746.pdf; Supplier: LCSC
USB1 = KH-TYPE-C-16P: 连接器类型:Type-C;标准:-;公母:母;端口数量:1;触点数量:16P;安装方式:卧贴;额定电流 - 电源:3A;工作温度范围:-40℃~+85℃;; LCSC Part Name: Type-C 母 卧贴; Supplier Part: C709357; Manufacturer: kinghelm(金航标); Supplier Footprint: SMD; Datasheet: https://atta.szlcsc.com/upload/public/pdf/source/20200911/C709357_AA8DCEB38BB20E3035A7ED7AE7667837.pdf; Supplier: LCSC; Connector Type: Type-C; Gender: 母; Number of Ports: 1; Number of Contacts: 16P; Mounting Style: 卧贴; Current Rating - Power (Max): 3A; Operating Temperature Range: -40℃~+85℃

## Nets
3V3: C8.1 C9.2 C10.2 C11.1 C12.1 C52.1 C53.2 C60.1 C65.1 C66.1 C77.2 C96.2 C97.2 C102.2 C112.1 H1.11 H2.1 H2.3 R2.2 R16.2 R36.1 R94.2 R95.2 R96.2 R97.2 R104.2 R105.1 U1.2(VDD3P3) U1.3(VDD3P3) U1.20(VDD3P3_RTC) U1.46(VDD3P3_CPU) U1.55(VDDA) U1.56(VDDA) U8.6(VS) U29.19(V5) U29.20(VDD33) U53.2 U71.2 U71.5 U83.2 U83.5 U84.2 U84.5 U85.2 U85.5 U86.2 U86.5 X2.2 X2.15 X2.16
+5V: C7.2 C95.2 C103.2 C104.2 H1.10 H2.5 H2.7 LED8.2(A) R15.2 R106.1 SW3.1 U4.5(IN)
GND: C1.1 C3.2 C4.2 C5.1 C6.2 C7.1 C8.2 C9.1 C10.1 C11.2 C12.2 C16.2 C17.2 C18.1 C19.1 C20.1 C21.1 C22.1 C23.1 C24.1 C25.2 C26.2 C27.2 C52.2 C53.1 C60.2 C65.2 C66.2 C70.1 C75.1 C79.1 C80.1 C81.1 C82.1 C83.1 C87.1 C88.2 C89.2 C90.2 C91.2 C92.2 C94.2 C95.1 C96.1 C97.1 C98.1 C99.1 C100.1 C101.1 C102.1 C103.1 C104.1 C105.2 C106.2 C107.2 C108.1 C109.2 C110.2 C111.2 C112.2 C113.1 H1.13 H2.9 H2.11 R1.2 R4.1 R9.1 R11.1 R17.1 R29.1 R46.2 R80.2 R86.2 R88.1 R89.2 R90.2 R102.2 R108.1 SW1.3 SW1.5 SW1.6 SW1.7 SW1.8 U1.57(GND) U2.2(GND) U2.4(ALT) U2.5(SCL) U2.6(SDA) U2.8(FB) U2.10(AGND) U2.11(GND) U4.2(GND) U8.1(A1) U8.2(A0) U8.7(GND) U15.2(GND) U15.4(GND) U27.2 U28.1 U29.25(GND) U31.4(GND) U31.9(EP) U32.11(GND) U51.6(GND) U51.9(EPAD) U52.2(A) U68.9(EP) U69.2(VSS) U69.5(B) U71.1 U71.4 U83.1 U83.4 U84.1 U84.4 U85.1 U85.4 U86.1 U86.4 U87.2(S) U88.2(S) U89.2 U92.2 U92.3 U92.4 USB1.1(EP) USB1.2(EP) USB1.3(EP) USB1.4(EP) USB1.A1(GND) USB1.A12(GND) USB1.B1(GND) USB1.B12(GND) X2.1 X2.7 X2.13 X2.14 X2.18 X2.19 X2.20 X3.2(GND) X3.4(GND)
VBUS: C18.2 C19.2 C20.2 C21.2 C70.2 C80.2 C81.2 C108.2 R10.1 R85.2 R87.1 U2.1(IN) U51.7(VIN) U82.2
BAT: C79.2 C113.2 R45.2 R81.2 R109.2 U66.2 U89.1
BUZ: R88.2 U1.8(GPIO3) U88.1(G)
CC1: U32.7(CC1) USB1.A5(CC1)
CC2: U32.6(CC2) USB1.B5(CC2)
CH549_DN: H2.12 U29.11(DM1)
CH549_DP: H2.10 U29.12(DP1)
DC+5V: C25.1 C26.1 C27.1 C88.1 C89.1 C106.1 U2.12(OUT) U68.1(VIN)
ESP32_DN: U1.25(GPIO19) U29.5(DM4)
ESP32_DP: U1.26(GPIO20) U29.6(DP4)
ESP32_RX: R56.1 U1.50(U0RXD) U85.3
ESP32_TX: R57.1 U1.49(U0TXD) U86.6
ESP_RESET: C1.2 R2.1 U1.4(CHIP_PU) U27.1
FB: R79.2 R103.1 U51.4(VSENSE)
FLASH_SPI_CLK: U1.33(SPICLK) U31.6(CLK)
FLASH_SPI_CS0: U1.32(SPICS0) U31.1(#CS)
FLASH_SPI_D: U1.35(SPID) U31.5(DI/IO0)
FLASH_SPI_HD: U1.30(SPIHD) U31.7(#HOLD-OR-#REST/IO3)
FLASH_SPI_Q: U1.34(SPIQ) U31.2(DO/IO1)
FLASH_SPI_WP: U1.31(SPIWP) U31.3(#WP/IO2)
GPIO0: R107.1 U1.5(GPIO0) U28.2
GPIO4_OUT: R49.1 U1.9(GPIO4) U71.6
GPIO5_OUT: R50.1 U1.10(GPIO5) U71.3
I2C_SCL: R95.1 U1.27(GPIO21) U8.5(SCL) U69.3(SCL) X2.6
I2C_SCL_OUT: R51.1 R97.1 U1.12(GPIO7) U83.6
I2C_SDA: R94.1 U1.24(GPIO18) U8.4(SDA) U69.4(SDA) X2.5
I2C_SDA_OUT: R52.1 R96.1 U1.11(GPIO6) U83.3
KET_LEFT: C110.1 SW1.1 U1.44(MTCK)
KEY_PUSH: C109.1 R107.2 SW1.4 U1.45(MTDO)
KEY_RIGHT: C111.1 SW1.2 U1.43(GPIO38)
LCD_CS: R90.1 U1.21(XTAL_32K_P) X2.11
LCD_DC: U1.19(GPIO14) X2.12
LCD_RST: U1.15(GPIO10) X2.8
LCD_SCL: U1.14(GPIO9) X2.10
LCD_SDA: U1.13(GPIO8) X2.9
LCD_TOUCH_INT: U1.23(GPIO17) X2.3
LCD_TOUCH_RST: U1.22(XTAL_32K_N) X2.4
LED/BAT: LED3.1(C) R108.2 R109.1 U1.7(GPIO2)
NRESET: R55.1 U1.18(GPIO13) U85.6
PICO_DN: H2.8 U29.9(DM2)
PICO_DP: H2.6 U29.10(DP2)
POWER_CTRL: R101.2 U1.6(GPIO1)
SWCLK: R54.1 U1.17(GPIO12) U84.3
SWDIO: R53.1 U1.16(GPIO11) U84.6
USB_DN: U29.14(DMU) USB1.A7(DN1) USB1.B7(DN2)
USB_DP: U29.15(DPU) USB1.A6(DP1) USB1.B6(DP2)
USBA_DN: H2.4 U29.7(DM3)
USBA_DP: H2.2 U29.8(DP3)
USBVIN: U82.1 USB1.A4(VBUS) USB1.A9(VBUS) USB1.B4(VBUS) USB1.B9(VBUS)
VOUT: C75.2 C82.2 C83.2 C98.2 C99.2 C100.2 L1.2 R3.2 R79.1 U90.5(D) U90.6(D) U90.7(D) U90.8(D) U90.9(D)
VOUT_BUS+: R28.1 U8.8(VBUS) U8.10(IN+) U91.5(D) U91.6(D) U91.7(D) U91.8(D) U91.9(D)
VOUT_BUS-: C16.1 C17.1 H1.12 R8.2 R28.2 U8.9(IN–)
VSPI: C101.2 U1.29(VDD_SPI) U31.8(VCC)
X40MI: C5.2 U1.53(XTAL_N) U15.1
X40MO: C6.1 U1.54(XTAL_P) U15.3
XIN: U29.4(XI) X3.1(OSC1)
XOUT: U29.3(XO) X3.3(OSC2)
$1N2849: C23.2 U2.9(VCC)
$1N2854: C24.2 R11.2 U2.7(OC)
$1N2855: C22.2 R10.2 U2.3(EN)
$1N2856: C31.2 U2.16(BST1)
$1N2857: C31.1 U2.15(SW1) U19.1
$1N2858: C32.1 U2.14(SW2) U19.2
$1N2859: C32.2 U2.13(BST2)
$1N3511: C69.1 U51.1(BOOT)
$1N3513: C69.2 L1.1 U51.8(PH) U52.1(C)
$1N4027: C76.1 U4.6(LX) U53.1
$1N4028: C76.2 U4.1(BS)
$1N4032: R15.1 U4.4(EN)
$1N4033: C77.1 R16.1 R17.2 U4.3(FB)
$1N4911: C87.2 R81.1 U68.6(BAT)
$1N4912: U66.1 U68.7(SW)
$1N4917: R45.1 U68.3(LED2) U68.4(LED3)
$1N4920: LED7.1(C) R46.1
$1N4922: LED7.2(A) U68.2(LED1)
$1N4926: C90.1 C91.1 C92.1 C107.1 SW3.2 SW3.3 U68.8(VOUT)
$1N5377: U32.4(DP) U32.5(DM)
$1N5662: R85.1 U32.8(VBUS)
$1N5692: R86.1 U32.9(CFG1)
$1N5786: C94.1 R87.2 U32.1(VDD)
$1N6471: R3.1 R4.2
$1N6478: R8.1 R9.2
$1N11240: LED8.1(C) R89.1
$1N21252: R101.1 R102.1 U87.1(G)
$1N33508: R80.1 R103.2 U69.6(W)
$1N38664: C105.1 R105.2 R106.2 U69.1(VDD)
$1N42364: R6.2 U87.3(D)
$1N42368: R5.2 R6.1 U90.4(G) U91.4(G)
$1N42380: R5.1 U90.1(S) U90.2(S) U90.3(S) U91.1(S) U91.2(S) U91.3(S)
$2N6654: R1.1 U1.52(GPIO46)
$2N6663: C4.1 L4.2 U1.1(LNA_IN)
$2N6706: R29.2 X2.17
$2N10807: BUZZER1.2(-) D1.2(A) U88.3(D)
$2N15195: H1.9 R49.2
$2N15197: H1.8 R50.2
$2N15199: H1.7 R51.2
$2N15201: H1.6 R52.2
$2N15203: H1.5 R53.2
$2N15205: H1.4 R54.2
$2N15207: H1.3 R55.2
$2N15209: H1.2 R56.2
$2N15211: H1.1 R57.2
$2N31679: LED3.2(A) R36.2
$2N31792: BUZZER1.1(+) D1.1(K) R104.1
$2N40023: C3.1 L4.1 U92.1

Not connected (* = marked no-connect by the designer): U1 28(SPICS1)* 36(SPICLK_N)* 37(SPICLK_P)* 38(GPIO33)* 39(GPIO34)* 40(GPIO35)* 41(GPIO36)* 42(GPIO37)* 47(MTDI)* 48(MTMS)* 51(GPIO45)*; U8 3(Alert)*; U29 1(OVCUR#)* 2(NC.)* 13(LED3/SCL)* 16(RESET#/CDP)* 17(NC)* 18(PSELF)* 21(LED4/SDA)* 22(LED1)* 23(LED2)* 24(PWREN#)*; U32 2(CFG2)* 3(CFG3)* 10(PG)*; U51 2(NC)* 3(NC)* 5(ENA)*; U68 5(KEY)*; U86 3*; USB1 A8(SUB1)* B8(SUB2)*

## Notes on the sheets
sheet 1
- 需要大电流时保险丝可不焊
- TYPEC接口
- 快充诱骗电路
- DCDC+5V电路
- 电池充放电电路
- DC3V3电路
- R105/R106选择一个焊接
- 功率监测电路
- 可调电源电路
sheet 2
- USBHUB
- 1.27mm排针
- 2.54mm排针
- 当使用电池电压检测时R26不焊接
- GPIO40
- GPIO38
- GPIO39
- R107用于GPIO0
  的下拉进入下载模式
- 当使用LED时R108和R109不焊接
- 单片机最小系统
- 屏幕接口
- 蜂鸣器电路
